# EAGLE schematic GSM Playground V1_6 (EAGLE 5.06)
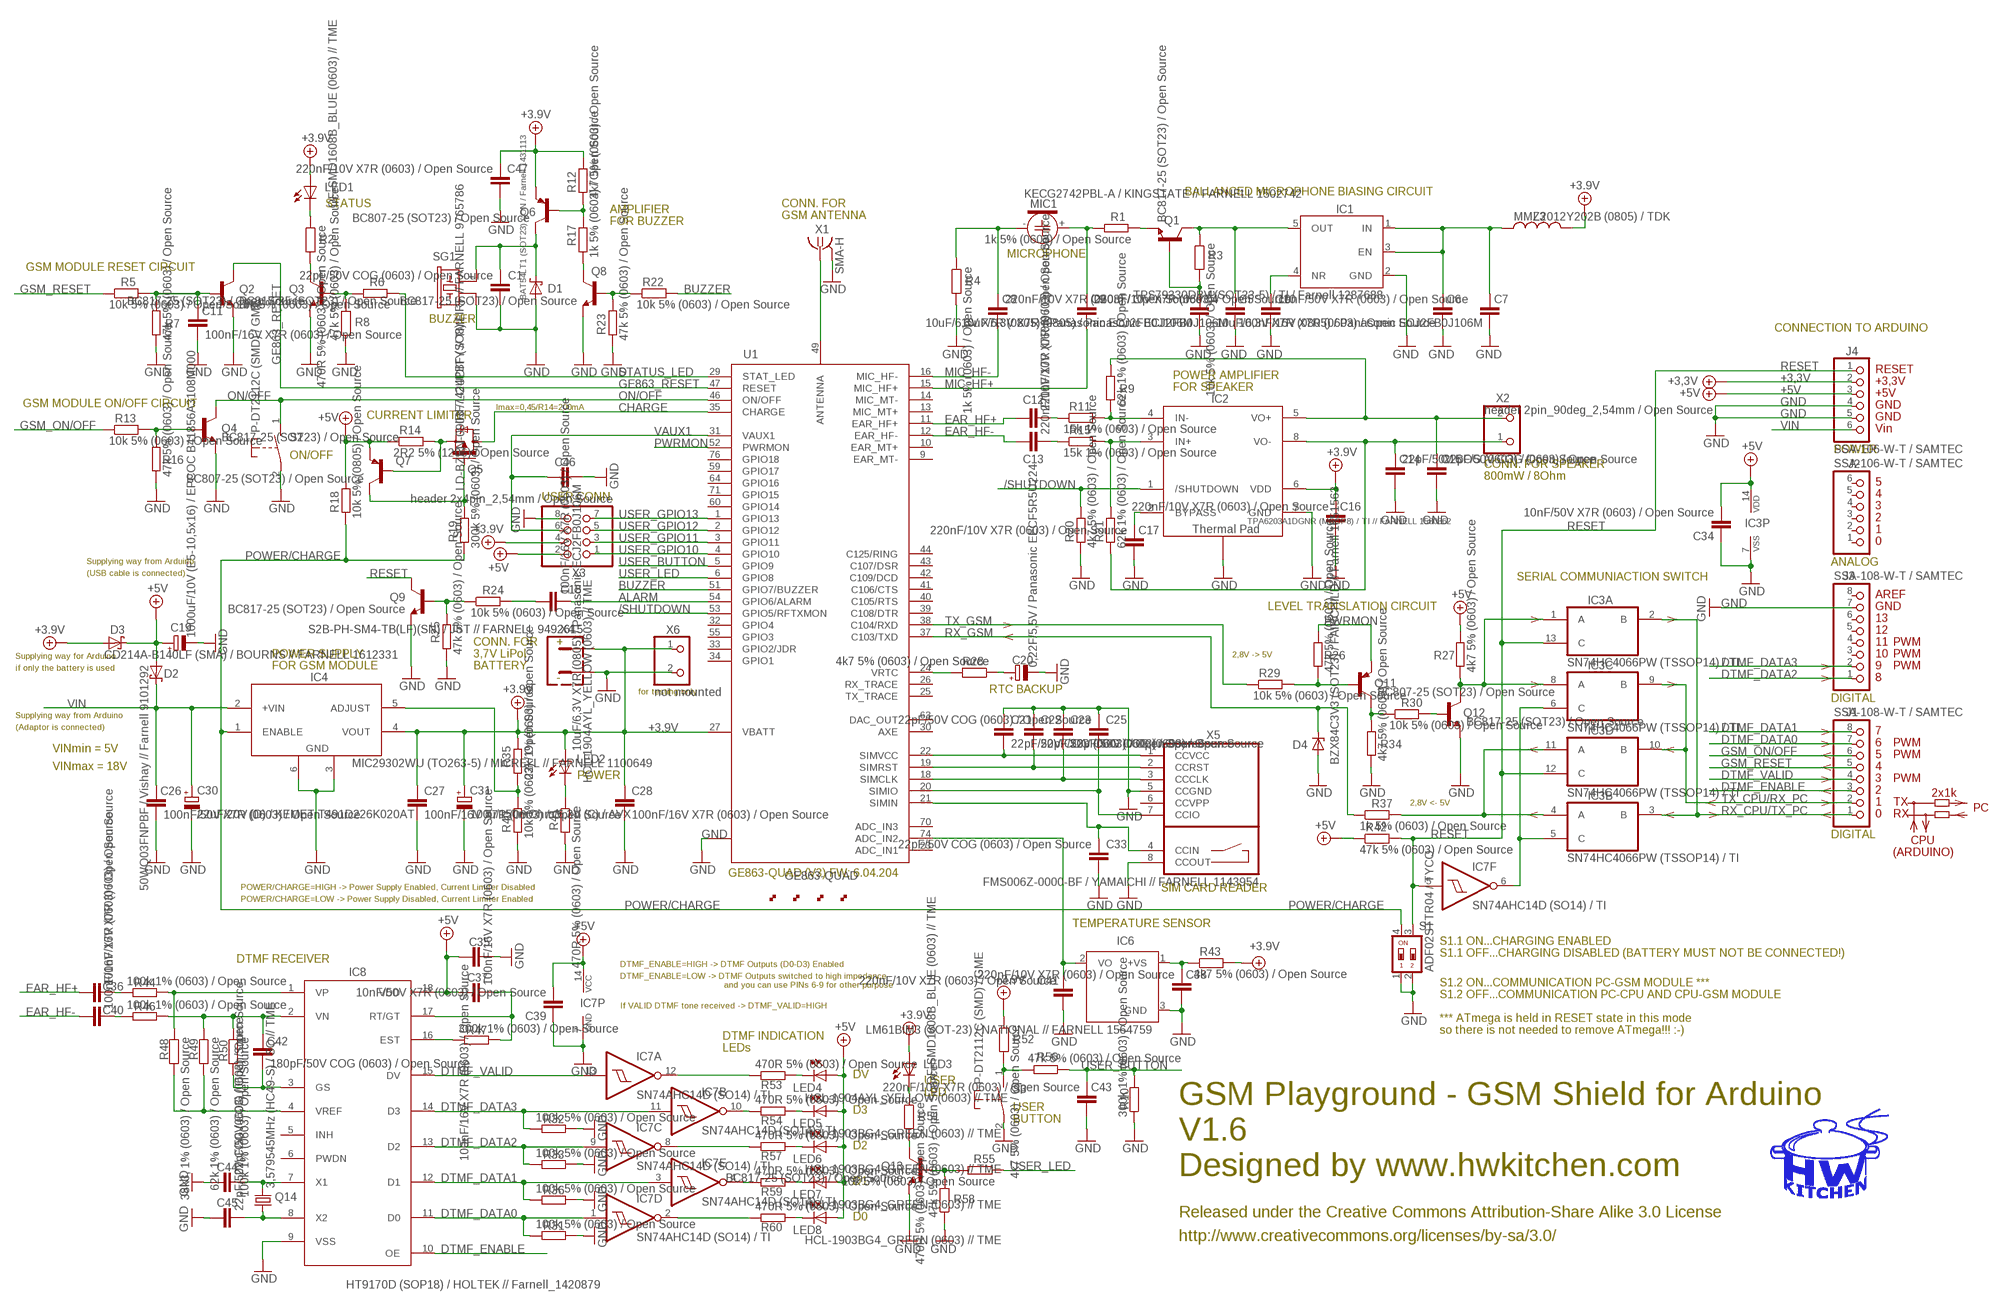
[diagram p0: schematic, sheet 1]

## Parts
C1  22pF/50V COG (0603) / Open Source  C-EUC0603  [C0603]
C4  10uF/6,3V X7R (0805) / Panasonic ECJ2FB0J106M  CAP0805  [C0805]
C5  10uF/6,3V X7R (0805) / Panasonic ECJ2FB0J106M  CAP0805  [C0805]
C6  100nF/16V X7R (0603) / Open Source  C-EUC0603  [C0603]
C7  10uF/6,3V X7R (0805) / Panasonic ECJ2FB0J106M  CAP0805  [C0805]
C8  220nF/10V X7R (0603) / Open Source  C-EUC0603  [C0603]
C9  220nF/10V X7R (0603) / Open Source  C-EUC0603  [C0603]
C10  10nF/50V X7R (0603) / Open Source  C-EUC0603  [C0603]
C11  100nF/16V X7R (0603) / Open Source  C-EUC0603  [C0603]
C12  220nF/10V X7R (0603) / Open Source  C-EUC0603  [C0603]
C13  220nF/10V X7R (0603) / Open Source  C-EUC0603  [C0603]
C14  22pF/50V COG (0603) / Open Source  C-EUC0603  [C0603]
C15  22pF/50V COG (0603) / Open Source  C-EUC0603  [C0603]
C16  220nF/10V X7R (0603) / Open Source  C-EUC0603  [C0603]
C17  220nF/10V X7R (0603) / Open Source  C-EUC0603  [C0603]
C18  100nF/16V X7R (0603) / Open Source  C-EUC0603  [C0603]
C19  1000uF/10V (E5-10,5x16) / EPCOC B41856A3108M000  CPOL-EUE5-10.5  [E5-10,5]
C20  0,22F/5,5V / Panasonic EECF5R5U224  POLCAP0.22F  [POLCAP0.22F]
C21  22pF/50V COG (0603) / Open Source  C-EUC0603  [C0603]
C22  22pF/50V COG (0603) / Open Source  C-EUC0603  [C0603]
C23  22pF/50V COG (0603) / Open Source  C-EUC0603  [C0603]
C25  22pF/50V COG (0603) / Open Source  C-EUC0603  [C0603]
C26  100nF/50V X7R (0603) / Open Source  C-EUC0603  [C0603]
C27  100nF/16V X7R (0603) / Open Source  C-EUC0603  [C0603]
C28  100nF/16V X7R (0603) / Open Source  C-EUC0603  [C0603]
C30  22uF/20V (D) / KEMET T491D226K020AT  CTD  [CT_D]
C31  100u/150mOhm/6,3V (C) / AVX  CTC  [CT_C]
C33  22pF/50V COG (0603) / Open Source  C-EUC0603  [C0603]
C34  10nF/50V X7R (0603) / Open Source  C-EUC0603  [C0603]
C35  100nF/16V X7R (0603) / Open Source  C-EUC0603  [C0603]
C36  100nF/16V X7R (0603) / Open Source  C-EUC0603  [C0603]
C37  100nF/16V X7R (0603) / Open Source  C-EUC0603  [C0603]
C38  220nF/10V X7R (0603) / Open Source  C-EUC0603  [C0603]
C39  10nF/50V X7R (0603) / Open Source  C-EUC0603  [C0603]
C40  100nF/16V X7R (0603) / Open Source  C-EUC0603  [C0603]
C41  220nF/10V X7R (0603) / Open Source  C-EUC0603  [C0603]
C42  180pF/50V COG (0603) / Open Source  C-EUC0603  [C0603]
C43  220nF/10V X7R (0603) / Open Source  C-EUC0603  [C0603]
C44  22pF/50V COG (0603) / Open Source  C-EUC0603  [C0603]
C45  22pF/50V COG (0603) / Open Source  C-EUC0603  [C0603]
C46  10uF/6,3V X7R (0805) / Panasonic ECJ2FB0J106M  CAP0805  [C0805]
C47  220nF/10V X7R (0603) / Open Source  C-EUC0603  [C0603]
D1  BAT54LT1 (SOT23) / ON / Farnell 1431113  BAT42SOT23  [SOT23_OO]
D2  50WQ03FNPBF / Vishay // Farnell 9101292  50WQ03FNPBF  [TO-252AA]
D3  CD214A-B140LF (SMA) / BOURNS // FARNELL 1612331  CD214A  [DO-214AC]
D4  BZX84C3V3 (SOT23) / FAIRCHILD // Farnell 1651563  BZX84CXX  [SOT23]
IC1  TPS79330DBV (SOT23-5) / TI / Farnell 1287688  TPS79330DBV  [SOT23-5]
IC2  TPA6203A1DGNR (MSOP8) / TI // FARNELL 1580362  TPA6203A1_H  [MSOP8_H]
IC3  SN74HC4066PW (TSSOP14) / TI  4066TSSOP14  [TSSOP14]
IC4  MIC29302WU (TO263-5) / MICRELL // FARNELL 1100649  MIC29302WU  [TO263-5]
IC6  LM61BIM3 (SOT-23) / NATIONAL // FARNELL 1564759  LM61  [SOT23]
IC7  SN74AHC14D (SO14) / TI  7414D  [SO14_O]
IC8  HT9170D (SOP18) / HOLTEK // Farnell_1420879  HT9170D  [SO18W]
J1  SSA-108-W-T / SAMTEC  PINHD-1X8  [1X08]
J2  SSA-106-W-T / SAMTEC  PINHD-1X6  [1X06]
J3  SSA-108-W-T / SAMTEC  PINHD-1X8  [1X08]
J4  SSA-106-W-T / SAMTEC  PINHD-1X6  [1X06]
L3  MMZ2012Y202B (0805) / TDK  L_JCI-2012-10UH  [JCI]
LED1  OF-SMD1608B_BLUE (0603) // TME  LEDCHIP-LED0603  [CHIP-LED0603]
LED2  HCL-1904AYL_YELLOW (0603) // TME  LEDCHIP-LED0603  [CHIP-LED0603]
LED3  OF-SMD1608B_BLUE (0603) // TME  LEDCHIP-LED0603  [CHIP-LED0603]
LED4  HCL-1904AYL_YELLOW (0603) // TME  LEDCHIP-LED0603  [CHIP-LED0603]
LED5  HCL-1903BG4_GREEN (0603) // TME  LEDCHIP-LED0603  [CHIP-LED0603]
LED6  HCL-1903BG4_GREEN (0603) // TME  LEDCHIP-LED0603  [CHIP-LED0603]
LED7  HCL-1903BG4_GREEN (0603) // TME  LEDCHIP-LED0603  [CHIP-LED0603]
LED8  HCL-1903BG4_GREEN (0603) // TME  LEDCHIP-LED0603  [CHIP-LED0603]
MIC1  KECG2742PBL-A / KINGSTATE // FARNELL 1502742  KECG2742PBL-A  [KECG2742PBL-A]
Q1  BC817-25 (SOT23) / Open Source  BC847B  [SOT23_O]
Q2  BC817-25 (SOT23) / Open Source  BC847B  [SOT23_O]
Q3  BC817-25 (SOT23) / Open Source  BC847B  [SOT23_O]
Q4  BC817-25 (SOT23) / Open Source  BC847B  [SOT23_O]
Q5  IRF7424PBF (SO8) / IRF // FARNELL 9765786  IRF7424  [SO08]
Q6  BC807-25 (SOT23) / Open Source  BC857B  [SOT23_0]
Q7  BC807-25 (SOT23) / Open Source  BC857B  [SOT23_0]
Q8  BC817-25 (SOT23) / Open Source  BC847B  [SOT23_O]
Q9  BC817-25 (SOT23) / Open Source  BC847B  [SOT23_O]
Q11  BC807-25 (SOT23) / Open Source  BC857B  [SOT23_0]
Q12  BC817-25 (SOT23) / Open Source  BC847B  [SOT23_O]
Q13  BC817-25 (SOT23) / Open Source  BC847B  [SOT23_O]
Q14  3,579545MHz (HC49-S) / SQ // TME  CRYTALHC49S  [HC49/S]
R1  1k 5% (0603) / Open Source  R-EU_R0603  [R0603]
R2  470R 5% (0603) / Open Source  R-EU_R0603  [R0603]
R3  10k 5% (0603) / Open Source  R-EU_R0603  [R0603]
R4  1k 5% (0603) / Open Source  R-EU_R0603  [R0603]
R5  10k 5% (0603) / Open Source  R-EU_R0603  [R0603]
R6  10k 5% (0603) / Open Source  R-EU_R0603  [R0603]
R7  47k 5% (0603) / Open Source  R-EU_R0603  [R0603]
R8  47k 5% (0603) / Open Source  R-EU_R0603  [R0603]
R9  62k 1% (0603) / Open Source  R-EU_R0603  [R0603]
R10  300k 1% (0603) / Open Source  R-EU_R0603  [R0603]
R11  15k 1% (0603) / Open Source  R-EU_R0603  [R0603]
R12  4k7 5% (0603) / Open Source  R-EU_R0603  [R0603]
R13  10k 5% (0603) / Open Source  R-EU_R0603  [R0603]
R14  2R2 5% (1206) / Open Source  R-EU_R1206  [R1206]
R15  15k 1% (0603) / Open Source  R-EU_R0603  [R0603]
R16  47k 5% (0603) / Open Source  R-EU_R0603  [R0603]
R17  1k 5% (0603) / Open Source  R-EU_R0603  [R0603]
R18  10k 5% (0805) / Open Source  R-EU_R0805  [R0805]
R19  300k 5% (0603) / Open Source  R-EU_R0603  [R0603]
R20  4k7 5% (0603) / Open Source  R-EU_R0603  [R0603]
R21  62k 1% (0603) / Open Source  R-EU_R0603  [R0603]
R22  10k 5% (0603) / Open Source  R-EU_R0603  [R0603]
R23  47k 5% (0603) / Open Source  R-EU_R0603  [R0603]
R24  10k 5% (0603) / Open Source  R-EU_R0603  [R0603]
R25  47k 5% (0603) / Open Source  R-EU_R0603  [R0603]
R26  47k 5% (0603) / Open Source  R-EU_R0603  [R0603]
R27  4k7 5% (0603) / Open Source  R-EU_R0603  [R0603]
R28  4k7 5% (0603) / Open Source  R-EU_R0603  [R0603]
R29  10k 5% (0603) / Open Source  R-EU_R0603  [R0603]
R30  10k 5% (0603) / Open Source  R-EU_R0603  [R0603]
R31  100k 5% (0603) / Open Source  R-EU_R0603  [R0603]
R32  100k 5% (0603) / Open Source  R-EU_R0603  [R0603]
R33  100k 5% (0603) / Open Source  R-EU_R0603  [R0603]
R34  4k7 5% (0603) / Open Source  R-EU_R0603  [R0603]
R35  22k 1% (0603) / Open Source  R-EU_R0603  [R0603]
R36  100k 5% (0603) / Open Source  R-EU_R0603  [R0603]
R37  1k 5% (0603) / Open Source  R-EU_R0603  [R0603]
R40  10k 1% (0603) / Open Source  R-EU_R0603  [R0603]
R41  470R 5% (0603) / Open Source  R-EU_R0603  [R0603]
R42  47k 5% (0603) / Open Source  R-EU_R0603  [R0603]
R43  4k7 5% (0603) / Open Source  R-EU_R0603  [R0603]
R44  100k 1% (0603) / Open Source  R-EU_R0603  [R0603]
R46  100k 1% (0603) / Open Source  R-EU_R0603  [R0603]
R47  300k 1% (0603) / Open Source  R-EU_R0603  [R0603]
R48  38k3, 1% (0603) / Open Source  R-EU_R0603  [R0603]
R49  62k 1% (0603) / Open Source  R-EU_R0603  [R0603]
R50  100k 1% (0603) / Open Source  R-EU_R0603  [R0603]
R51  470R 5% (0603) / Open Source  R-EU_R0603  [R0603]
R52  4k7 5% (0603) / Open Source  R-EU_R0603  [R0603]
R53  470R 5% (0603) / Open Source  R-EU_R0603  [R0603]
R54  470R 5% (0603) / Open Source  R-EU_R0603  [R0603]
R55  10k 5% (0603) / Open Source  R-EU_R0603  [R0603]
R56  47k 5% (0603) / Open Source  R-EU_R0603  [R0603]
R57  470R 5% (0603) / Open Source  R-EU_R0603  [R0603]
R58  47k 5% (0603) / Open Source  R-EU_R0603  [R0603]
R59  470R 5% (0603) / Open Source  R-EU_R0603  [R0603]
R60  470R 5% (0603) / Open Source  R-EU_R0603  [R0603]
S1  ADF02STTR04 / TYCO  SWS002  [SMS-002]
S2  P-DT2112C (SMD) / GME  P-DT2112C_SMD  [P-DT2112C]
S3  P-DT2112C (SMD) / GME  P-DT2112C_SMD  [P-DT2112C]
SG1  LD-BZEN-0903 / LOUDITY // TME  LD-BZEN-0903  [LD-BZEN-0903]
U1  GE863-QUAD  [GE863-QUAD]
U$11  MARK  [MARK]
U$12  MARK  [MARK]
U$13  MARK  [MARK]
U$14  MARK  [MARK]
X1  SMA-H  [SMA-H]
X2  header 2pin_90deg_2,54mm / Open Source  PINHD-1X290  [1X02/90]
X3  header 2x4pin_2,54mm / Open Source  PINHD-2X4  [2X04]
X4  S2B-PH-SM4-TB(LF)(SN) / JST // FARNELL 9492615  CON02  [CON_BAT]
X5  FMS006Z-0000-BF / YAMAICHI // FARNELL 1143954  SIM_CARD_READER_FMS  [SIM_CARD_READER]
X6  not mounted  PINHD-1X2  [1X02]

## Nets
+3,3V: J4.2
+3.9V: C16.2 C27.1 C28.1 C31.+ C47.2 D3.A IC2.6(VDD) IC4.4(VOUT) L3.P$4 LED1.A LED2.A LED3.A Q6.2(E) R12.2 R35.2 R43.2 R52.1 U1.27(VBATT) X3.4 X4.2 X6.1
+5V: C19.+ C34.2 C35.2 C37.1 C39.2 D2.1(A) D2.3(A1) D3.C IC3.14(P:VDD) IC7.14(P:VCC) IC8.18(VDD) J4.3 LED4.A LED5.A LED6.A LED7.A LED8.A Q7.2(E) R14.1 R18.2 R27.2 R42.1 X3.2
/SHUTDOWN: IC2.1(/SHUTDOWN) R20.2 U1.53(GPIO5/RFTXMON)
ALARM: C18.2 U1.54(GPIO6/ALARM)
BUZZER: R22.2 U1.51(GPIO7/BUZZER)
CHARGE: Q5.5 Q5.6 Q5.7 Q5.8 U1.35(CHARGE)
DTMF_DATA0: IC7.1(D:I) IC8.11(D0) J1.7 R31.1
DTMF_DATA1: IC7.3(E:I) IC8.12(D1) J1.8 R36.1
DTMF_DATA2: IC7.9(C:I) IC8.13(D2) J3.1 R33.1
DTMF_DATA3: IC7.11(B:I) IC8.14(D3) J3.2 R32.1
DTMF_ENABLE: IC8.10(OE) J1.3
DTMF_VALID: IC7.13(A:I) IC8.15(DV) J1.4
EAR_HF+: C12.1 C36.1 U1.11(EAR_HF+)
EAR_HF-: C13.1 C40.1 U1.12(EAR_HF-)
GE863_RESET: Q2.3(C) U1.47(RESET)
GND: C1.1 C4.P$4 C5.P$4 C6.2 C7.P$4 C10.1 C11.2 C14.1 C15.1 C16.1 C17.1 C19.- C20.- C21.1 C22.1 C23.1 C25.2 C26.2 C27.2 C28.2 C30.- C31.- C33.1 C34.1 C35.1 C38.1 C39.1 C41.1 C43.1 C44.1 C45.1 C46.P$4 C47.1 D1.1(A) D4.1(A) IC1.2(GND) IC2.7(GND) IC2.9(THERMALPAD) IC3.7(P:VSS) IC4.3(GND) IC4.6(GND) IC6.3(GND) IC7.7(P:GND) IC8.9(VSS) J3.7 J4.4 J4.5 Q2.2(E) Q3.2(E) Q4.2(E) Q8.2(E) Q9.2(E) Q12.2(E) Q13.2(E) R4.2 R7.1 R8.1 R10.1 R16.1 R20.1 R23.1 R25.1 R31.2 R32.2 R33.2 R34.1 R36.2 R40.1 R41.2 R58.1 S1.1 S1.2 S2.2 S3.2 SG1.- U1.8(GND) U1.17(GND) U1.28(GND) U1.36(GND) U1.45(GND) U1.48(GND) U1.50(GND) U1.56(GND) U1.67(GND) U1.69(GND) U1.72(GND) U1.77(GND) U1.79(GND) X1.2 X1.3 X1.4 X1.5 X3.8 X4.1 X5.5(CCGND) X5.8(CCOUT) X6.2
GSM_ON/OFF: J1.6 R13.1
GSM_RESET: J1.5 R5.1
MIC_HF+: C9.1 U1.15(MIC_HF+)
MIC_HF-: C8.1 U1.16(MIC_HF-)
N$1: IC7.12(A:O) R53.1
N$2: C11.1 Q2.1(B) R5.2 R7.2
N$3: Q4.1(B) R13.2 R16.2
N$4: Q11.1(B) R26.1 R29.2
N$5: Q11.3(C) R30.1 R34.2
N$6: Q12.1(B) R30.2
N$7: IC3.1(A:A) IC3.8(C:A) Q12.3(C) R27.1
N$8: C6.1 C7.P$1 IC1.1(IN) IC1.3(EN) L3.P$1
N$9: Q3.1(B) R6.2 R8.2
N$10: R28.2 U1.24(VRTC)
N$11: IC3.4(B:A) IC3.11(D:A) R37.2
N$12: C20.+ R28.1
N$13: LED2.C R41.1
N$14: U1.49(ANTENNA) X1.1
N$15: C5.P$1 IC1.5(OUT) Q1.3(C) R3.1
N$16: LED1.C R2.1
N$17: IC4.5(ADJUST) R35.1 R40.2
N$18: C21.2 U1.22(SIMVCC) X5.1(CCVCC)
N$19: C22.2 U1.19(SIMRST) X5.2(CCRST)
N$20: C23.2 U1.18(SIMCLK) X5.3(CCCLK)
N$21: C25.1 U1.20(SIMIO) X5.7(CCIO)
N$22: C33.2 U1.21(SIMIN) X5.4(CCIN)
N$23: Q3.3(C) R2.2
N$24: C4.P$1 Q1.1(B) R3.2
N$27: C9.2 MIC1.+ R1.2
N$28: C8.2 MIC1.- R4.1
N$29: Q1.2(E) R1.1
N$31: C17.2 IC2.2(BYPASS)
N$32: C10.2 IC1.4(NR)
N$33: C14.2 IC2.8(VO-) R21.1 X2.1
N$34: C1.2 D1.3(C) Q6.3(C) SG1.+
N$35: Q8.1(B) R22.1 R23.2
N$36: C15.2 IC2.5(VO+) R9.2 X2.2
N$37: IC7.10(B:O) R54.1
N$38: Q9.1(B) R24.1 R25.2
N$39: C18.1 R24.2
N$40: IC2.4(IN-) R9.1 R11.2
N$41: IC2.3(IN+) R15.2 R21.2
N$42: C42.1 IC8.2(VN) R46.2 R49.1 R50.1
N$43: Q13.1(B) R55.2 R58.2
N$44: C12.2 R11.1
N$45: C13.2 R15.1
N$46: C42.2 IC8.3(GS) R50.2
N$47: IC8.1(VP) R44.2 R48.1
N$48: C36.2 R44.1
N$49: C40.2 R46.1
N$50: IC8.4(VREF) R48.2 R49.2
N$51: IC7.8(C:O) R57.1
N$52: IC8.16(EST) R47.1
N$53: C37.2 IC8.17(RT/GT) R47.2
N$54: C44.2 IC8.7(X1) Q14.2
N$55: C45.2 IC8.8(X2) Q14.1
N$56: IC7.4(E:O) R59.1
N$57: IC7.2(D:O) R60.1
N$58: LED4.C R53.2
N$59: LED5.C R54.2
N$60: LED6.C R57.2
N$61: LED7.C R59.2
N$62: LED8.C R60.2
N$67: Q5.1 Q5.2 Q5.3 Q7.1(B) R14.2
N$68: Q8.3(C) R17.1
N$69: Q5.4 Q7.3(C) R19.2
N$70: Q6.1(B) R12.1 R17.2
N$74: LED3.C R51.1
N$75: Q13.3(C) R51.2
N$77: C38.2 IC6.1(+VS) R43.1
N$78: R52.2 R56.1 S3.1
N$79: C41.2 IC6.2(VO) U1.74(ADC_IN2)
ON/OFF: Q4.3(C) S2.1 U1.46(ON/OFF)
POWER/CHARGE: IC4.1(ENABLE) R18.1 R19.1 S1.4
PWRMON: Q11.2(E) R26.2 U1.52(PWRMON)
RESET: IC3.12(D:C) IC3.13(A:C) IC7.5(F:I) J4.1 Q9.3(C) R42.2 S1.3
RX_CPU/TX_PC: IC3.2(A:B) IC3.3(B:B) J1.1
RX_GSM: D4.3(C) R37.1 U1.37(C103/TXD)
SDASDS: IC3.5(B:C) IC3.6(C:C) IC7.6(F:O)
STATUS_LED: R6.1 U1.29(STAT_LED)
TX_CPU/RX_PC: IC3.9(C:B) IC3.10(D:B) J1.2
TX_GSM: R29.1 U1.38(C104/RXD)
USER_BUTTON: C43.2 R10.2 R56.2 U1.5(GPIO9)
USER_GPIO10: U1.4(GPIO10) X3.1
USER_GPIO11: U1.3(GPIO11) X3.3
USER_GPIO12: U1.2(GPIO12) X3.5
USER_GPIO13: U1.1(GPIO13) X3.7
USER_LED: R55.1 U1.6(GPIO8)
VAUX1: C46.P$1 U1.31(VAUX1) X3.6
VIN: C26.1 C30.+ D2.4(C) IC4.2(+VIN) J4.6
Unconnected: IC8.5(INH) IC8.6(PWDN) J2.1 J2.2 J2.3 J2.4 J2.5 J2.6 J3.3 J3.4 J3.5 J3.6 J3.8 U1.9(EAR_MT-) U1.10(EAR_MT+) U1.13(MIC_MT+) U1.14(MIC_MT-) U1.23(ADC_IN1) U1.25(TX_TRACE) U1.26(RX_TRACE) U1.30(AXE) U1.32(GPIO4) U1.33(GPIO2/JDR) U1.34(GPIO1) U1.39(C108/DTR) U1.40(C105/RTS) U1.41(C106/CTS) U1.42(C109/DCD) U1.43(C107/DSR) U1.44(C125/RING) U1.55(GPIO3) U1.59(GPIO17) U1.60(GPIO14) U1.63(DAC_OUT) U1.64(GPIO16) U1.70(ADC_IN3) U1.71(GPIO15) U1.76(GPIO18) X5.6(CCVPP)

## Notes on the sheet
- BALLANCED MICROPHONE BIASING CIRCUIT
- STATUS | CONN. FOR
- AMPLIFIER
- GSM ANTENNA
- FOR BUZZER
- MICROPHONE
- GSM MODULE RESET CIRCUIT
- BUZZER
- CONNECTION TO ARDUINO
- RESET
- POWER AMPLIFIER
- +3,3V
- FOR SPEAKER
- +5V
- GSM MODULE ON/OFF CIRCUIT | GND
- Imax=0,45/R14=200mA
- CURRENT LIMITER | GND
- Vin
- POWER
- ON/OFF
- CONN. FOR SPEAKER
- 800mW / 8Ohm
- 5
- USER CONN. | 4
- 3
- 2
- 1
- 0
- Supplying way from Arduino | ANALOG
- (USB cable is connected)
- SERIAL COMMUNIACTION SWITCH
- AREF
- LEVEL TRANSLATION CIRCUIT | GND
- 13
- 12
- CONN. FOR | + | 11 | PWM
- Supplying way for Arduino | POWER SUPPLY | 3,7V LiPol | 2,8V -> 5V | 10 | PWM
- if only the battery is used | FOR GSM MODULE | BATTERY | 9 | PWM
- - | 8
- for testing only | RTC BACKUP
- DIGITAL
- Supplying way from Arduino
- (Adaptor is connected)
- 7
- 6 | PWM
- VINmin = 5V
- 5 | PWM
- VINmax = 18V | 4
- POWER | 3 | PWM
- 2 | 2x1k
- 2,8V <- 5V | 1 | TX
- PC
- 0 | RX
- DIGITAL
- CPU
- (ARDUINO)
- GE863-QUAD (V3) FW: 6.04.204
- POWER/CHARGE=HIGH -> Power Supply Enabled, Current Limiter Disabled | SIM CARD READER
- POWER/CHARGE=LOW -> Power Supply Disabled, Current Limiter Enabled
- TEMPERATURE SENSOR
- S1.1 ON...CHARGING ENABLED
- S1.1 OFF...CHARGING DISABLED (BATTERY MUST NOT BE CONNECTED!)
- DTMF RECEIVER
- DTMF_ENABLE=HIGH -> DTMF Outputs (D0-D3) Enabled
- DTMF_ENABLE=LOW -> DTMF Outputs switched to high impedance
- and you can use PINs 6-9 for other purpose | S1.2 ON...COMMUNICATION PC-GSM MODULE ***
- S1.2 OFF...COMMUNICATION PC-CPU AND CPU-GSM MODULE
- If VALID DTMF tone received -> DTMF_VALID=HIGH
- *** ATmega is held in RESET state in this mode
- so there is not needed to remove ATmega!!! :-)
- DTMF INDICATION
- LEDs
- DV
- USER
- LED
- GSM Playground - GSM Shield for Arduino
- D3 | USER
- BUTTON
- V1.6
- D2
- Designed by www.hwkitchen.com
- D1
- D0 | Released under the Creative Commons Attribution-Share Alike 3.0 License
- http://www.creativecommons.org/licenses/by-sa/3.0/

## Library data of the parts
C1 C6 C8-C18 C21-C23 C25-C28 C33-C45 C47 = rcl:C-EU: CAPACITOR, European symbol
C4 C5 C7 C46 = HW-FUN:CAP
C19 = rcl:CPOL-EU: POLARIZED CAPACITOR, European symbol
C20 = HW-FUN:POLCAP0.22F
C30 C31 = HW-FUN:CT
D1 = diode:BAT42: DIODE barrier diode
D2 = HW-FUN:50WQ03FNPBF
D3 = HW-FUN:CD214A
D4 = HW-FUN:BZX84CXX
IC1 = HW-FUN:TPS79330
IC2 = HW-FUN:TPA6203A1
IC3 = 40xx:4066: Quad bilateral ANALOG SWITCH
IC4 = HW-FUN:MIC29302
IC6 = HW-FUN:LM61
IC7 = 74xx-eu:74*14: Hex schmitt trigger INVERTER
IC8 = HW-FUN:HT9170
J1 J3 = pinhead:PINHD-1X8: PIN HEADER
J2 J4 = pinhead:PINHD-1X6: PIN HEADER
L3 = HW-FUN:L_
LED1-LED8 = led:LED: LED OSRAM: - CHIPLED LG R971, LG N971, LY N971, LG Q971, LY Q971, LO R971, LY R971 LH N974, LH R974 LS Q976, LO Q976, LY Q976 LO Q996 - Hyper CHIPLED LW Q18S LB Q993, LB Q99A, LB R99A - SideLED LS A670, LO A670, LY A670, LG A670, LP A670 LB A673, LV A673, LT A673, LW A673 LH A674 LY A675 LS A676, LA A676, LO A676, LY A676, LW A676 LS A679, LY A679, LG A679 - Hyper Micro SIDELED® LS Y876, LA Y876, LO Y876, LY Y876 LT Y87S - SmartLED LW L88C, LW L88S LB L89C, LB L89S, LG L890 LS L89K, LO L89K, LY L89K LS L896, LA L896, LO L896, LY L896 - TOPLED LS T670, LO T670, LY T670, LG T670, LP T670 LSG T670, LSP T670, LSY T670, LOP T670, LYG T670 LG T671, LOG T671, LSG T671 LB T673, LV T673, LT T673, LW T673 LH T674 LS T676, LA T676, LO T676, LY T676, LB T676, LH T676, LSB T676, LW T676 LB T67C, LV T67C, LT T67C, LS T67K, LO T67K, LY T67K, LW E67C LS E67B, LA E67B, LO E67B, LY E67B, LB E67C, LV E67C, LT E67C LW T67C LS T679, LY T679, LG T679 LS T770, LO T770, LY T770, LG T770, LP T770 LB T773, LV T773, LT T773, LW T773 LH T774 LS E675, LA E675, LY E675, LS T675 LS T776, LA T776, LO T776, LY T776, LB T776 LHGB T686 LT T68C, LB T68C - Hyper Mini TOPLED® LB M676 - Mini TOPLED Santana® LG M470 LS M47K, LO M47K, LY M47K Source: http://www.osram.convergy.de LUXEON: - LUMILED® LXK2-PW12-R00, LXK2-PW12-S00, LXK2-PW14-U00, LXK2-PW14-V00 LXK2-PM12-R00, LXK2-PM12-S00, LXK2-PM14-U00 LXK2-PE12-Q00, LXK2-PE12-R00, LXK2-PE12-S00, LXK2-PE14-T00, LXK2-PE14-U00 LXK2-PB12-K00, LXK2-PB12-L00, LXK2-PB12-M00, LXK2-PB14-N00, LXK2-PB14-P00, LXK2-PB14-Q00 LXK2-PR12-L00, LXK2-PR12-M00, LXK2-PR14-Q00, LXK2-PR14-R00 LXK2-PD12-Q00, LXK2-PD12-R00, LXK2-PD12-S00 LXK2-PH12-R00, LXK2-PH12-S00 LXK2-PL12-P00, LXK2-PL12-Q00, LXK2-PL12-R00 Source: www.luxeon.com KINGBRIGHT: KA-3528ASYC Source: www.kingbright.com
MIC1 = HW-FUN:KECG2742PBL-A
Q1-Q4 Q8 Q9 Q12 Q13 = transistor-npn:BC847*: NPN Transistor
Q5 = HW-FUN:IRF7424
Q6 Q7 Q11 = transistor-pnp:BC857*: PNP Transistror
Q14 = crystal:CRYTAL: CRYSTAL
R1-R37 R40-R44 R46-R60 = rcl:R-EU_: RESISTOR, European symbol
S1 = smd-special:SWS002: SMD Dip Switch 2 pol.
S2 S3 = HW-FUN:P-DT2112C
SG1 = HW-FUN:LD-BZEN-0903
U1 = HW-FUN:GE863-QUAD
U$11-U$14 = HW-FUN:MARK
X1 = HW-FUN:SMA-H
X2 X6 = pinhead:PINHD-1X2: PIN HEADER
X3 = pinhead:PINHD-2X4: PIN HEADER
X4 = HW-FUN:CON02
X5 = HW-FUN:SIM_CARD_READER

## Net classes
1 power: width 0.61 mm, drill 0.508 mm, clearance 0.152 mm
2 gnd: width 0.305 mm, drill 0.508 mm, clearance 0.152 mm
3 usbvcc: width 0.508 mm, drill 0.508 mm, clearance 0.152 mm
4 aref: width 0.406 mm